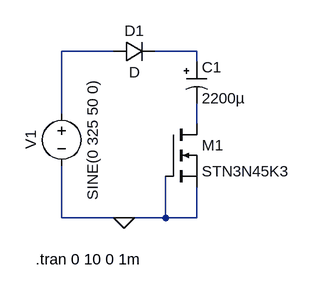
[diagram p0: schematic fullwave-doubler-1V02.asc]
fullwave-doubler-1V02.asc, the LTspice schematic file:
Version 4
SHEET 1 880 680
WIRE 160 -48 80 -48
WIRE 288 -48 224 -48
WIRE 288 -32 288 -48
WIRE 80 48 80 -48
WIRE 288 64 288 32
WIRE 80 208 80 128
WIRE 176 208 80 208
WIRE 240 208 240 144
WIRE 240 208 176 208
WIRE 288 208 288 160
WIRE 288 208 240 208
FLAG 176 208 0
SYMBOL voltage 80 32 R0
WINDOW 0 -32 56 VBottom 2
WINDOW 3 32 56 VTop 2
WINDOW 123 0 0 Left 2
WINDOW 39 0 0 Left 2
SYMATTR InstName V1
SYMATTR Value SINE(0 325 50 0)
SYMBOL polcap 272 -32 R0
SYMATTR InstName C1
SYMATTR Value 2200µ
SYMATTR Description Capacitor
SYMATTR Type cap
SYMATTR SpiceLine V=6.3 Irms=34m Rser=2.4 Lser=0
SYMBOL nmos 240 64 R0
SYMATTR InstName M1
SYMATTR Value STN3N45K3
SYMBOL diode 160 -32 R270
WINDOW 0 32 32 VTop 2
WINDOW 3 0 32 VBottom 2
SYMATTR InstName D1
TEXT 40 272 Left 2 !.tran 0 10 0 1m

The netlist it stands for:
* fullwave-doubler-1V02.asc
V1 N001 0 SINE(0 325 50 0)
C1 N002 N003 2200µ V=6.3 Irms=34m Rser=2.4 Lser=0
M1 N003 0 0 0 STN3N45K3
D1 N001 N002 D
.model D D
.lib standard.dio
.model NMOS NMOS
.model PMOS PMOS
.lib standard.mos
.tran 0 10 0 1m
.backanno
.end